# Altium project Fastino-DIOT.PrjPCB (part 7 of 8)

## Sheet Fastino-connectors.schdoc: Fastino v1.2
size 420 x 297 mm; EDA_Number: ARTIQ; Projet: Fastino; Author: G.Kasprowicz; CompanyName: WUT ISE; DrawnBy: G.Kasprowicz; Organization: WUT ISE; Address1: PW ISE; Address2: Nowowiejska 15/19 00-665 Warsaw; Address3: gkasprow@gmail.com; DocumentNumber: 1; Revision: 2; SheetNumber: 6; SheetTotal: 11; ModifiedBy: -; CheckedDate: -; Title2: AFE connectors; DivGrp: WUT ISE; Designer: G.Kasprowicz; ModifiedDate: -; ProjectName: Sensor Box
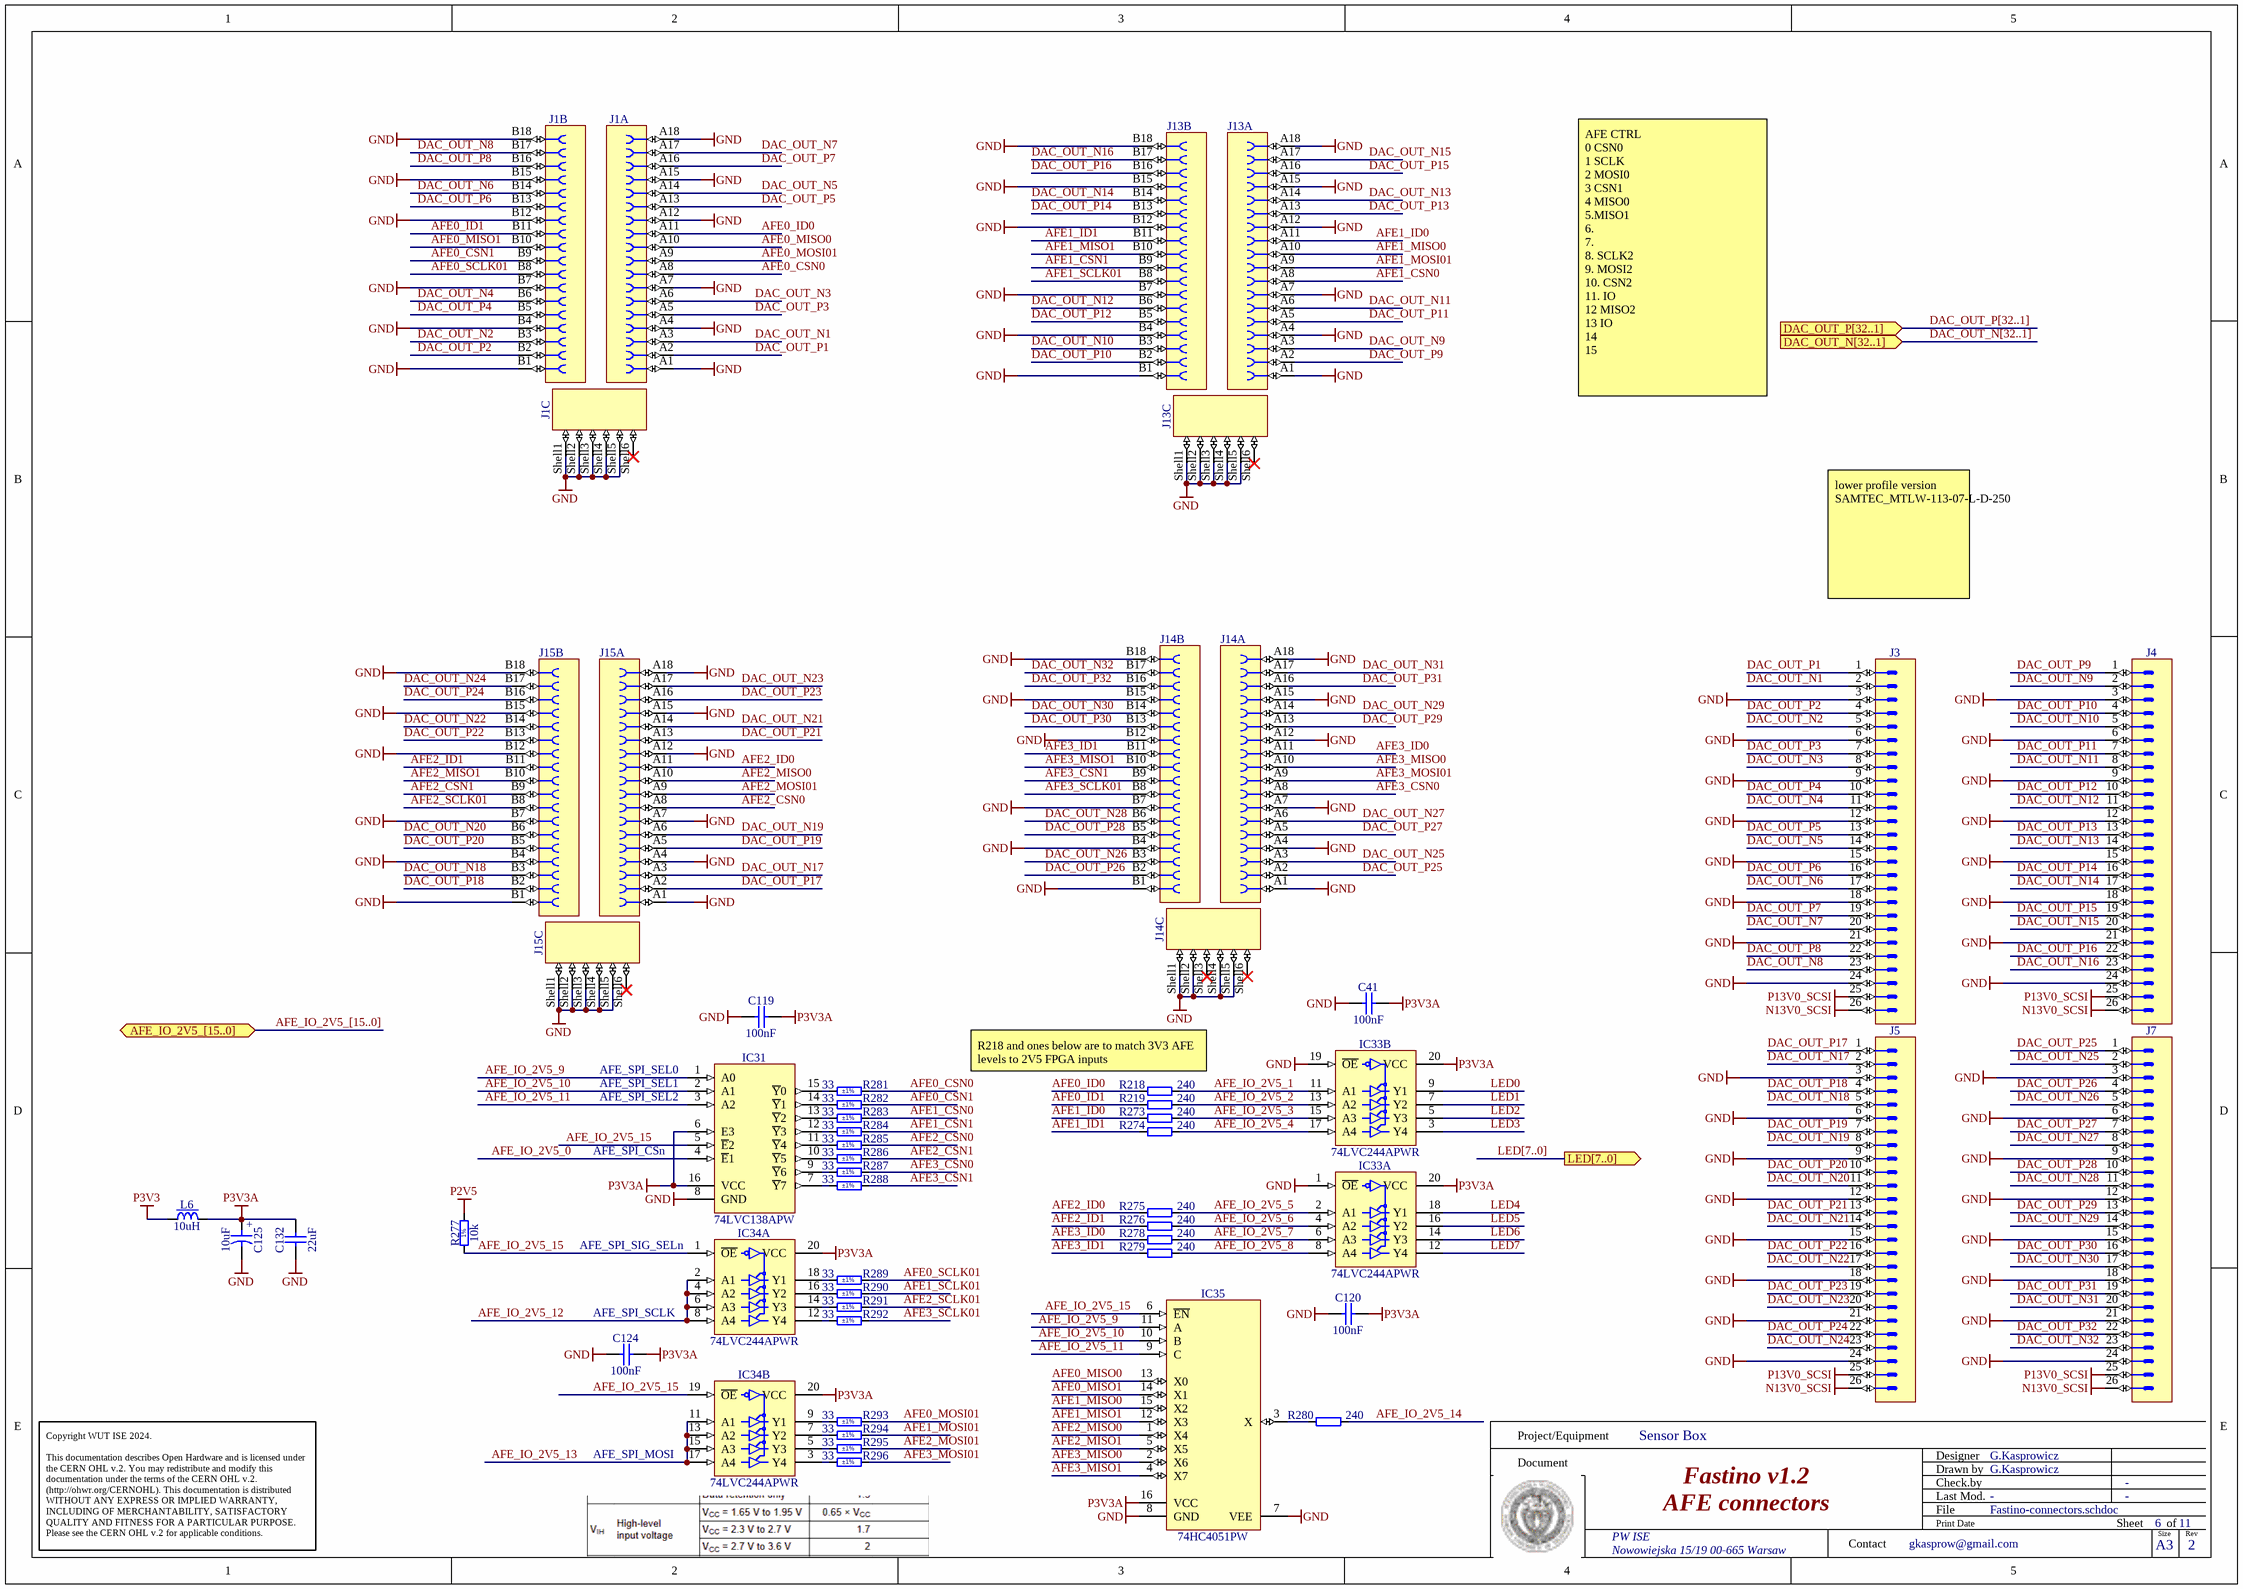
[diagram p11: Fastino-connectors.schdoc]

### Parts
C41  100nF  [CAPC1005X55N]
C119  100nF  [CAPC1005X55N]
C120  100nF  [CAPC1005X55N]
C124  100nF  [CAPC1005X55N]
C125  10uF  [CAPMP3216X180N]
C132  22uF  [CAPC2012X135N]
IC31  74LVC138APW  [SOP65P640X110-16N]
IC33  74LVC244APWR  [SOP65P640X110-20N]  (parts A,B of 2)
IC34  74LVC244APWR  [SOP65P640X110-20N]  (parts A,B of 2)
IC35  74HC4051PW  [SOP65P640X120-16N]
J1  iPass™  [MOLEX_75783-0107]  (value not drawn)  (parts A,B,C of 3)
J3  Header 26  [3M_N2526-6002RB]  (value not drawn)
J4  Header 26  [3M_N2526-6002RB]  (value not drawn)
J5  Header 26  [3M_N2526-6002RB]  (value not drawn)
J7  Header 26  [3M_N2526-6002RB]  (value not drawn)
J13  iPass™  [MOLEX_75783-0107]  (value not drawn)  (parts A,B,C of 3)
J14  iPass™  [MOLEX_75783-0107]  (value not drawn)  (parts A,B,C of 3)
J15  iPass™  [MOLEX_75783-0107]  (value not drawn)  (parts A,B,C of 3)
L6  10uH  [IND_MURATA-PS_8400]
R218  240  [RESC1005X40N]
R219  240  [RESC1005X40N]
R273  240  [RESC1005X40N]
R274  240  [RESC1005X40N]
R275  240  [RESC1005X40N]
R276  240  [RESC1005X40N]
R277  10k  [RESC1005X40N]
R278  240  [RESC1005X40N]
R279  240  [RESC1005X40N]
R280  240  [RESC1005X40N]
R281  33  Tolerance: ±1%  [RESC1005X40N]
R282  33  Tolerance: ±1%  [RESC1005X40N]
R283  33  Tolerance: ±1%  [RESC1005X40N]
R284  33  Tolerance: ±1%  [RESC1005X40N]
R285  33  Tolerance: ±1%  [RESC1005X40N]
R286  33  Tolerance: ±1%  [RESC1005X40N]
R287  33  Tolerance: ±1%  [RESC1005X40N]
R288  33  Tolerance: ±1%  [RESC1005X40N]
R289  33  Tolerance: ±1%  [RESC1005X40N]
R290  33  Tolerance: ±1%  [RESC1005X40N]
R291  33  Tolerance: ±1%  [RESC1005X40N]
R292  33  Tolerance: ±1%  [RESC1005X40N]
R293  33  Tolerance: ±1%  [RESC1005X40N]
R294  33  Tolerance: ±1%  [RESC1005X40N]
R295  33  Tolerance: ±1%  [RESC1005X40N]
R296  33  Tolerance: ±1%  [RESC1005X40N]

### Ports
AFE_IO_2V5_[15..0] (bidir), DAC_OUT_N[32..1] (in), DAC_OUT_P[32..1] (in), LED[7..0] (out)

### Nets
GND: C41.1 C119.1 C120.1 C124.1 C125.2 C132.1 IC31.8(GND) IC33.1(~{OE}) IC33.10(GND) IC33.19(~{OE}) IC34.10(GND) IC35.7(VEE) IC35.8(GND) J1.A1 J1.A4 J1.A7 J1.A12 J1.A15 J1.A18 J1.B1 J1.B4 J1.B7 J1.B12 J1.B15 J1.B18 J1.Shell1 J1.Shell2 J1.Shell3 J1.Shell4 J1.Shell5 J3.3 J3.6 J3.9 J3.12 J3.15 J3.18 J3.21 J3.24 J4.3 J4.6 J4.9 J4.12 J4.15 J4.18 J4.21 J4.24 J5.3 J5.6 J5.9 J5.12 J5.15 J5.18 J5.21 J5.24 J7.3 J7.6 J7.9 J7.12 J7.15 J7.18 J7.21 J7.24 J13.A1 J13.A4 J13.A7 J13.A12 J13.A15 J13.A18 J13.B1 J13.B4 J13.B7 J13.B12 J13.B15 J13.B18 J13.Shell1 J13.Shell2 J13.Shell3 J13.Shell4 J13.Shell5 J14.A1 J14.A4 J14.A7 J14.A12 J14.A15 J14.A18 J14.B1 J14.B4 J14.B7 J14.B12 J14.B15 J14.B18 J14.Shell1 J14.Shell2 J14.Shell4 J14.Shell5 J15.A1 J15.A4 J15.A7 J15.A12 J15.A15 J15.A18 J15.B1 J15.B4 J15.B7 J15.B12 J15.B15 J15.B18 J15.Shell1 J15.Shell2 J15.Shell3 J15.Shell4 J15.Shell5
N13V0_SCSI: J3.26 J4.26 J5.26 J7.26
P2V5: R277.2
P3V3: L6.1
P3V3A: C41.2 C119.2 C120.2 C124.2 C125.1 C132.2 IC31.6(E3) IC31.16(VCC) IC33.20(VCC) IC34.20(VCC) IC35.16(VCC) L6.2
P13V0_SCSI: J3.25 J4.25 J5.25 J7.25
AFE0_CSN0: J1.A8 R281.2
AFE0_CSN1: J1.B9 R282.2
AFE0_ID0: J1.A11 R218.1
AFE0_ID1: J1.B11 R219.1
AFE0_MISO0: IC35.13(X0) J1.A10
AFE0_MISO1: IC35.14(X1) J1.B10
AFE0_MOSI01: J1.A9 R293.2
AFE0_SCLK01: J1.B8 R289.2
AFE1_CSN0: J13.A8 R283.2
AFE1_CSN1: J13.B9 R284.2
AFE1_ID0: J13.A11 R273.1
AFE1_ID1: J13.B11 R274.1
AFE1_MISO0: IC35.15(X2) J13.A10
AFE1_MISO1: IC35.12(X3) J13.B10
AFE1_MOSI01: J13.A9 R294.2
AFE1_SCLK01: J13.B8 R290.2
AFE2_CSN0: J15.A8 R285.2
AFE2_CSN1: J15.B9 R286.2
AFE2_ID0: J15.A11 R275.1
AFE2_ID1: J15.B11 R276.1
AFE2_MISO0: IC35.1(X4) J15.A10
AFE2_MISO1: IC35.5(X5) J15.B10
AFE2_MOSI01: J15.A9 R295.2
AFE2_SCLK01: J15.B8 R291.2
AFE3_CSN0: J14.A8 R287.2
AFE3_CSN1: J14.B9 R288.2
AFE3_ID0: J14.A11 R278.1
AFE3_ID1: J14.B11 R279.1
AFE3_MISO0: IC35.2(X6) J14.A10
AFE3_MISO1: IC35.4(X7) J14.B10
AFE3_MOSI01: J14.A9 R296.2
AFE3_SCLK01: J14.B8 R292.2
AFE_IO_2V5_0: IC31.4(~{E}1)
AFE_IO_2V5_1: IC33.11(A1) R218.2
AFE_IO_2V5_2: IC33.13(A2) R219.2
AFE_IO_2V5_3: IC33.15(A3) R273.2
AFE_IO_2V5_4: IC33.17(A4) R274.2
AFE_IO_2V5_5: IC33.2(A1) R275.2
AFE_IO_2V5_6: IC33.4(A2) R276.2
AFE_IO_2V5_7: IC33.6(A3) R278.2
AFE_IO_2V5_8: IC33.8(A4) R279.2
AFE_IO_2V5_9: IC31.1(A0) IC35.11(A)
AFE_IO_2V5_10: IC31.2(A1) IC35.10(B)
AFE_IO_2V5_11: IC31.3(A2) IC35.9(C)
AFE_IO_2V5_12: IC34.2(A1) IC34.4(A2) IC34.6(A3) IC34.8(A4)
AFE_IO_2V5_13: IC34.11(A1) IC34.13(A2) IC34.15(A3) IC34.17(A4)
AFE_IO_2V5_14: R280.2
AFE_IO_2V5_15: IC31.5(~{E}2) IC34.1(~{OE}) IC34.19(~{OE}) IC35.6(~{EN}) R277.1
DAC_OUT_N1: J1.A3 J3.2  [project net DAC_OUT_N]
DAC_OUT_N2: J1.B3 J3.5  [project net DAC_OUT_N]
DAC_OUT_N3: J1.A6 J3.8  [project net DAC_OUT_N]
DAC_OUT_N4: J1.B6 J3.11  [project net DAC_OUT_N]
DAC_OUT_N5: J1.A14 J3.14  [project net DAC_OUT_N]
DAC_OUT_N6: J1.B14 J3.17  [project net DAC_OUT_N]
DAC_OUT_N7: J1.A17 J3.20  [project net DAC_OUT_N]
DAC_OUT_N8: J1.B17 J3.23  [project net DAC_OUT_N]
DAC_OUT_N9: J4.2 J13.A3  [project net DAC_OUT_N]
DAC_OUT_N10: J4.5 J13.B3  [project net DAC_OUT_N]
DAC_OUT_N11: J4.8 J13.A6  [project net DAC_OUT_N]
DAC_OUT_N12: J4.11 J13.B6  [project net DAC_OUT_N]
DAC_OUT_N13: J4.14 J13.A14  [project net DAC_OUT_N]
DAC_OUT_N14: J4.17 J13.B14  [project net DAC_OUT_N]
DAC_OUT_N15: J4.20 J13.A17  [project net DAC_OUT_N]
DAC_OUT_N16: J4.23 J13.B17  [project net DAC_OUT_N]
DAC_OUT_N17: J5.2 J15.A3  [project net DAC_OUT_N]
DAC_OUT_N18: J5.5 J15.B3  [project net DAC_OUT_N]
DAC_OUT_N19: J5.8 J15.A6  [project net DAC_OUT_N]
DAC_OUT_N20: J5.11 J15.B6  [project net DAC_OUT_N]
DAC_OUT_N21: J5.14 J15.A14  [project net DAC_OUT_N]
DAC_OUT_N22: J5.17 J15.B14  [project net DAC_OUT_N]
DAC_OUT_N23: J5.20 J15.A17  [project net DAC_OUT_N]
DAC_OUT_N24: J5.23 J15.B17  [project net DAC_OUT_N]
DAC_OUT_N25: J7.2 J14.A3  [project net DAC_OUT_N]
DAC_OUT_N26: J7.5 J14.B3  [project net DAC_OUT_N]
DAC_OUT_N27: J7.8 J14.A6  [project net DAC_OUT_N]
DAC_OUT_N28: J7.11 J14.B6  [project net DAC_OUT_N]
DAC_OUT_N29: J7.14 J14.A14  [project net DAC_OUT_N]
DAC_OUT_N30: J7.17 J14.B14  [project net DAC_OUT_N]
DAC_OUT_N31: J7.20 J14.A17  [project net DAC_OUT_N]
DAC_OUT_N32: J7.23 J14.B17  [project net DAC_OUT_N]
DAC_OUT_P1: J1.A2 J3.1  [project net DAC_OUT_P]
DAC_OUT_P2: J1.B2 J3.4  [project net DAC_OUT_P]
DAC_OUT_P3: J1.A5 J3.7  [project net DAC_OUT_P]
DAC_OUT_P4: J1.B5 J3.10  [project net DAC_OUT_P]
DAC_OUT_P5: J1.A13 J3.13  [project net DAC_OUT_P]
DAC_OUT_P6: J1.B13 J3.16  [project net DAC_OUT_P]
DAC_OUT_P7: J1.A16 J3.19  [project net DAC_OUT_P]
DAC_OUT_P8: J1.B16 J3.22  [project net DAC_OUT_P]
DAC_OUT_P9: J4.1 J13.A2  [project net DAC_OUT_P]
DAC_OUT_P10: J4.4 J13.B2  [project net DAC_OUT_P]
DAC_OUT_P11: J4.7 J13.A5  [project net DAC_OUT_P]
DAC_OUT_P12: J4.10 J13.B5  [project net DAC_OUT_P]
DAC_OUT_P13: J4.13 J13.A13  [project net DAC_OUT_P]
DAC_OUT_P14: J4.16 J13.B13  [project net DAC_OUT_P]
DAC_OUT_P15: J4.19 J13.A16  [project net DAC_OUT_P]
DAC_OUT_P16: J4.22 J13.B16  [project net DAC_OUT_P]
DAC_OUT_P17: J5.1 J15.A2  [project net DAC_OUT_P]
DAC_OUT_P18: J5.4 J15.B2  [project net DAC_OUT_P]
DAC_OUT_P19: J5.7 J15.A5  [project net DAC_OUT_P]
DAC_OUT_P20: J5.10 J15.B5  [project net DAC_OUT_P]
DAC_OUT_P21: J5.13 J15.A13  [project net DAC_OUT_P]
DAC_OUT_P22: J5.16 J15.B13  [project net DAC_OUT_P]
DAC_OUT_P23: J5.19 J15.A16  [project net DAC_OUT_P]
DAC_OUT_P24: J5.22 J15.B16  [project net DAC_OUT_P]
DAC_OUT_P25: J7.1 J14.A2  [project net DAC_OUT_P]
DAC_OUT_P26: J7.4 J14.B2  [project net DAC_OUT_P]
DAC_OUT_P27: J7.7 J14.A5  [project net DAC_OUT_P]
DAC_OUT_P28: J7.10 J14.B5  [project net DAC_OUT_P]
DAC_OUT_P29: J7.13 J14.A13  [project net DAC_OUT_P]
DAC_OUT_P30: J7.16 J14.B13  [project net DAC_OUT_P]
DAC_OUT_P31: J7.19 J14.A16  [project net DAC_OUT_P]
DAC_OUT_P32: J7.22 J14.B16  [project net DAC_OUT_P]
LED0: IC33.9(Y1)
LED1: IC33.7(Y2)
LED2: IC33.5(Y3)
LED3: IC33.3(Y4)
LED4: IC33.18(Y1)
LED5: IC33.16(Y2)
LED6: IC33.14(Y3)
LED7: IC33.12(Y4)
NetIC31_7: IC31.7(~{Y}7) R288.1
NetIC31_9: IC31.9(~{Y}6) R287.1
NetIC31_10: IC31.10(~{Y}5) R286.1
NetIC31_11: IC31.11(~{Y}4) R285.1
NetIC31_12: IC31.12(~{Y}3) R284.1
NetIC31_13: IC31.13(~{Y}2) R283.1
NetIC31_14: IC31.14(~{Y}1) R282.1
NetIC31_15: IC31.15(~{Y}0) R281.1
NetIC34_3: IC34.3(Y4) R296.1
NetIC34_5: IC34.5(Y3) R295.1
NetIC34_7: IC34.7(Y2) R294.1
NetIC34_9: IC34.9(Y1) R293.1
NetIC34_12: IC34.12(Y4) R292.1
NetIC34_14: IC34.14(Y3) R291.1
NetIC34_16: IC34.16(Y2) R290.1
NetIC34_18: IC34.18(Y1) R289.1
NetIC35_3: IC35.3(X) R280.1

Not connected (* = marked no-connect by the designer): J1 Shell6*; J13 Shell6*; J14 Shell3* Shell6*; J15 Shell6*

### Buses and harness runs
bus AFE_IO_2V5_[15..0] = port AFE_IO_2V5_[15..0]
bus DAC_OUT_N[32..1] = port DAC_OUT_N[32..1]
bus DAC_OUT_P[32..1] = port DAC_OUT_P[32..1]
bus LED[7..0] = port LED[7..0]

### Notes on the sheet
- AFE CTRL
  0 CSN0
  1 SCLK
  2 MOSI0
  3 CSN1
  4 MISO0
  5.MISO1
  6.
  7.
  8. SCLK2
  9. MOSI2
  10. CSN2
  11. IO
  12 MISO2
  13 IO
  14
  15
- lower profile version
  SAMTEC_MTLW-113-07-L-D-250
- (near IC31) AFE_SPI_SEL0
- R218 and ones below are to match 3V3 AFE levels to 2V5 FPGA inputs
- (near IC31) AFE_SPI_SEL1
- (near IC31) AFE_SPI_SEL2
- AFE_SPI_CSn
- AFE_SPI_SIG_SELn
- AFE_SPI_SCLK
- (near IC34) AFE_SPI_MOSI
- Project/Equipment
- Document
- Designer
- Drawn by
- Check.by
- Copyright WUT ISE 2024.
  This documentation describes Open Hardware and is licensed under the CERN OHL v.2. You may redistribute and modify this documentation under the terms of the CERN OHL v.2. (http://ohwr.org/CERNOHL). This documentation is distributed WITHOUT ANY EXPRESS OR IMPLIED WARRANTY, INCLUDING OF MERCHANTABILITY, SATISFACTORY QUALITY AND FITNESS FOR A PARTICULAR PURPOSE. Please see the CERN OHL v.2 for applicable conditions.
- Contact
- File
- Last Mod.
- Print Date
- Sheet
- Size
- A3
- of
- Rev
- (in symbol CTE3216-18_10UF_16V_20%_AVX_TCJ) +
- (in symbol R0402_10K_1%_0.0625W_100PPM) 1%

### Library data of the parts
C41 C119 C120 C124 = CC0402_100NF_16V_10%_X5R: Non-polarised capacitor; Part Description: SMD Multilayer Chip Ceramic Capacitor; Manufacturer: GENERIC; Manufacturer1 Part Number: GRM155R61C104KA88D; Voltage: 16V; TC: X5R; Tolerance: ±10%; Part Number: CC0402_100NF_16V_10%_X5R; Component Kind: Standard; Component Type: Standard; Pin Count: 2; Value: 100nF; Status: None; Manufacturer Part Number: CC0402_100NF_16V_10%_X5R; Case: 0402; Mounted: Yes; Socket: No; SMD: Yes; Sense: No; Manufacturer1 Example: MURATA; Manufacturer1 ComponentHeight: 0.55mm; HelpURL: \\cern.ch\dfs\Applications\Altium\Datasheets\CC0402_X5R_MURATA_GRM.pdf; Author: CERN DEM JLC; CreateDate: 10.12.2013; LatestRevisionDate: 10.12.2013
C125 = CTE3216-18_10UF_16V_20%_AVX_TCJ: Polarised capacitor; Part Description: ESR 0R200 Tantalum Solid Electrolytic Chip Capacitor with Conductive Polymer Electrode; Manufacturer: AVX; Manufacturer Part Number: TCJA106M016R0200 or  or TR3A106K016C1700; Voltage: 16V; Tolerance: ±20%; Part Number: CTE3216-18_10UF_16V_20%_AVX_TCJ; Component Kind: Standard; Component Type: Standard; Pin Count: 2; Value: 10uF; Status: Preferred; Case: A; Mounted: Yes; Socket: No; SMD: Yes; Sense: No; ComponentHeight: 1.8mm; HelpURL: \\cern.ch\dfs\Applications\Altium\Datasheets\CTE_AVX_TCJ.pdf; Author: CERN DEM JLC; CreateDate: 29.03.2012; LatestRevisionDate: 29.03.2012
C132 = CC0805_22UF_16V_10%_X5R: Non-polarised capacitor; Part Description: SMD Multilayer Chip Ceramic Capacitor; Manufacturer: GENERIC; Manufacturer1 Part Number: C2012X5R1C226KT; Voltage: 16V; TC: X5R; Tolerance: ±10%; Part Number: CC0805_22UF_16V_10%_X5R; Component Kind: Standard; Component Type: Standard; Pin Count: 2; Value: 22uF; Status: Preferred; Manufacturer Part Number: CC0805_22UF_16V_10%_X5R; Case: 0805; Mounted: Yes; Socket: No; SMD: Yes; Sense: No; Manufacturer1 Example: TDK; Manufacturer1 ComponentHeight: 1.35mm; HelpURL: \\cern.ch\dfs\Applications\Altium\Datasheets\CC0805_X5R_TDK_C.pdf; Author: CERN DEM JLC; CreateDate: 25.10.2012; LatestRevisionDate: 25.10.2012
IC31 = 74LVC138APW: 3-Line to 8-Line Decoder/Demultiplexer; Part Description: 3-Line to 8-Line Decoder/Demultiplexer, Inverting; Manufacturer: NEXPERIA; PressFit: No; Bonding: No; Part Number: 74LVC138APW; Component Kind: Standard; Component Type: Standard; Device: 74LVC138APW; PackageDescription: SOP, 0.65mm Pitch; 16 Pin, 4.40mm W X 5.00mm L X 1.10mm H body IPC Medium Density; Manufacturer Part Number: 74LVC138APW; Pin Count: 16; Case: TSSOP16; Mounted: Yes; Socket: No; SMD: Yes; Sense: No; ComponentHeight: 1.1mm; Author: CERN DEM HF; HelpURL: \\cern.ch\dfs\Applications\Altium\Datasheets\74LVC138A.pdf; CreateDate: 14.10.2022; LatestRevisionDate: 14.10.2022
IC33 IC34 = 74LVC244APW: Octal Buffer/Driver with 3-State Ouputs; Part Description: Octal Buffer/Driver with 3-State Outputs; Manufacturer: TEXAS INSTRUMENTS; PressFit: No; Bonding: No; Part Number: 74LVC244APWR; Component Kind: Standard; Component Type: Standard; Device: 74LVC244APWR; PackageDescription: SOP, 20-Leads, Body 6.6x4.5mm (max), Pitch 0.65mm, IPC Medium Density; Manufacturer Part Number: 74LVC244APW; Pin Count: 20; Case: TSSOP20; Mounted: Yes; Socket: No; SMD: Yes; Sense: No; ComponentHeight: 1.1mm; Author: GK; HelpURL: \\cern.ch\dfs\Applications\Altium\Datasheets\SN74LVC244A.pdf; CreateDate: 20.12.2010; LatestRevisionDate: 22.03.2021
IC35 = 74HC4051PW: 8-Channel Analog Multiplexer/Demultiplexer; Manufacturer: NXP; PressFit: No; Bonding: No; Part Number: 74HC4051PW; Component Kind: Standard; Component Type: Standard; Device: 74HC4051PW; PackageDescription: SOP, 0.65mm Pitch; 16 Pin, 4.40mm W X 5.00mm L X 1.20mm H body, IPC Medium Density; Part Description: 8-Channel Analog Multiplexer/Demultiplexer; Manufacturer Part Number: 74HC4051PW; Pin Count: 16; Case: TSSOP16; Mounted: Yes; Socket: No; SMD: Yes; Sense: No; ComponentHeight: 1.2mm; Author: GK; HelpURL: \\cern.ch\dfs\Applications\Altium\Datasheets\TC74HC4051AFT.pdf; CreateDate: 09.11.2011; LatestRevisionDate: 09.11.2011
J1 J13-J15 = MOLEX_75783-0107: 36 Circuit, Right Angle , Internal Assembly, iPass™ I/O Surface Mount Receptacle with Left Key Shell; Part Number: MOLEX 75783-0107 / 75783-0136; Manufacturer: MOLEX; Manufacturer Part Number: 75783-0107 / 75783-0136; PressFit: No; Component Kind: Standard; Component Type: Standard; Pin Count: 42; Family: iPass™; Mounted: Yes; Socket: No; SMD: Yes; Sense: No; Status: None; Part Description: 36 Circuit, Right Angle , Internal Assembly, iPass™ I/O Surface Mount Receptacle with Left Key Shell; ComponentHeight: 8.47mm; HelpURL: \\cern.ch\dfs\Applications\Altium\Datasheets\MOLEX_75783-0107.pdf; Author: CERN DEM JLC; CreateDate: 12.11.2014; LatestRevisionDate: 12.11.2014
J3-J5 J7 = 3M_N2526-6002RB: Connector 26 Male; Part Description: 26 Contacts - Straight .100'' x .100'' Low Profile Four-Wall Header, 2500 Series; Manufacturer: 3M; PressFit: No; Part Number: 3M_N2526-6002RB; Component Kind: Standard; Component Type: Standard; Pin Count: 26; Family: Header 26; Mounted: Yes; Socket: No; SMD: No; Sense: No; Status: None; Manufacturer Part Number: N2526-6002RB; ComponentHeight: 10.03mm; HelpURL: \\cern.ch\dfs\Applications\Altium\Datasheets\3M_N2526-6002RB.pdf; Author: CERN DEM JLC; CreateDate: 11.02.2009; LatestRevisionDate: 11.08.2009
L6 = IND_10UH_10%_MURATA-PS_8400: Inductor With Core; Part Description: Miniature Surface Mount Power Inductor (8400 Serie); Manufacturer: MURATA POWER SOLUTIONS; Manufacturer Part Number: 84103C; Power: 950mA; Resistance: 0.24R; Tolerance: ±10%; Part Number: IND_10UH_10%_MURATA-PS_8400; Component Kind: Standard; Component Type: Standard; Pin Count: 2; Value: 10uH; Status: None; Mounted: Yes; Socket: No; SMD: Yes; Sense: No; ComponentHeight: 2.9mm; HelpURL: \\cern.ch\dfs\Applications\Altium\Datasheets\IND_MURATA-PS_8400.pdf; Author: CERN DEM JLC; CreateDate: 02.07.2012; LatestRevisionDate: 02.07.2012
R218 R219 R273-R276 R278-R280 = R0402_240R_1%_0.0625W_100PPM: Resistor - 1%; Part Description: General Purpose Thick Film Chip Resistor; Manufacturer: GENERIC; Manufacturer1 Part Number: 232270672401L; TC: ±100ppm/°C; PressFit: No; Part Number: R0402_240R_1%_0.0625W_100PPM; Component Kind: Standard; Component Type: Standard; Pin Count: 2; Value: 240; Status: Not Recommended; Power: 0.0625W; Tolerance: ±1%; Manufacturer Part Number: R0402_240R_1%_0.0625W_100PPM; Case: 0402; Mounted: Yes; Sense: No; Socket: No; SMD: Yes; Manufacturer1 Example: YAGEO PHYCOMP; Manufacturer1 ComponentHeight: 0.4mm; HelpURL: \\cern.ch\dfs\Applications\Altium\Datasheets\R0402_Phycomp_RC0402.pdf; Author: CERN DEM JLC; CreateDate: 03.12.2007; LatestRevisionDate: 17.10.2012
R277 = R0402_10K_1%_0.0625W_100PPM: Resistor - 1%; Part Description: General Purpose Thick Film Chip Resistor; Manufacturer: GENERIC; Manufacturer1 Part Number: 232270671003L; TC: ±100ppm/°C; PressFit: No; Part Number: R0402_10K_1%_0.0625W_100PPM; Component Kind: Standard; Component Type: Standard; Pin Count: 2; Value: 10k; Status: Not Recommended; Power: 0.0625W; Tolerance: ±1%; Manufacturer Part Number: R0402_10K_1%_0.0625W_100PPM; Case: 0402; Mounted: Yes; Sense: No; Socket: No; SMD: Yes; Manufacturer1 Example: YAGEO PHYCOMP; Manufacturer1 ComponentHeight: 0.4mm; HelpURL: \\cern.ch\dfs\Applications\Altium\Datasheets\R0402_Phycomp_RC0402.pdf; Author: CERN DEM JLC; CreateDate: 03.12.2007; LatestRevisionDate: 17.10.2012
R281-R296 = R0402_33R_1%_0.0625W_100PPM: Resistor - 1%; Part Description: General Purpose Thick Film Chip Resistor; Manufacturer: GENERIC; Manufacturer1 Part Number: 232270673309L; TC: ±100ppm/°C; PressFit: No; Part Number: R0402_33R_1%_0.0625W_100PPM; Component Kind: Standard; Component Type: Standard; Pin Count: 2; Value: 33; Status: Not Recommended; Power: 0.0625W; Manufacturer Part Number: R0402_33R_1%_0.0625W_100PPM; Case: 0402; Mounted: Yes; Sense: No; Socket: No; SMD: Yes; Manufacturer1 Example: YAGEO PHYCOMP; Manufacturer1 ComponentHeight: 0.4mm; HelpURL: \\cern.ch\dfs\Applications\Altium\Datasheets\R0402_Phycomp_RC0402.pdf; Author: CERN DEM JLC; CreateDate: 03.12.2007; LatestRevisionDate: 17.10.2012